# Altium schematic sheet MCU.SchDoc
size A
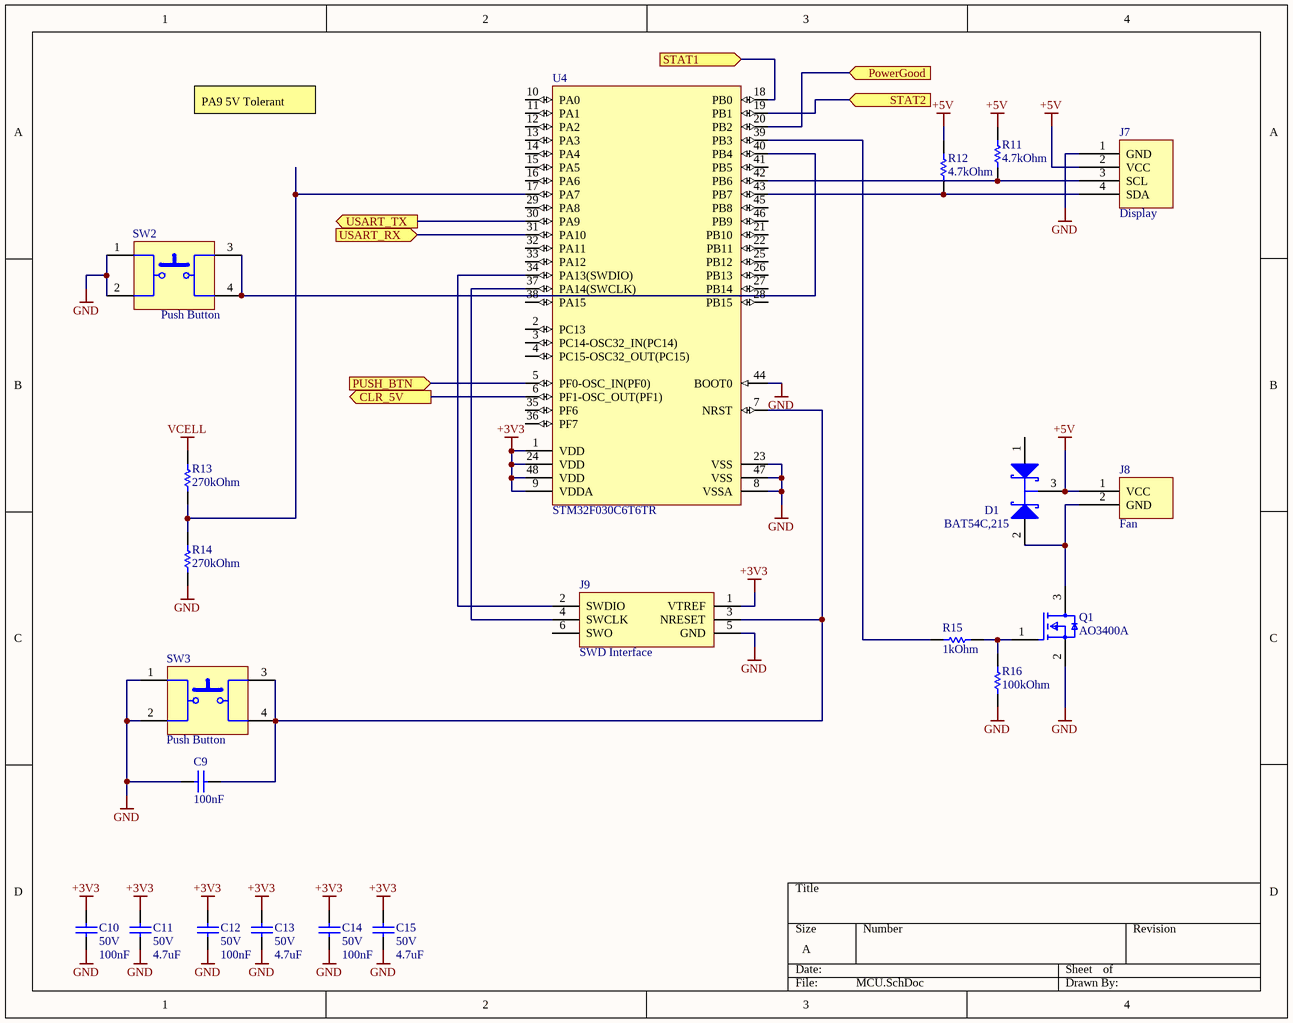
[diagram p0: MCU.SchDoc]

## Parts
C9  100nF  [CAP_0804]
C10  value 100nF  Voltage Rating: 50V  [CAPC2013X88X50ML20T25]  (hidden comment: Cap_0805)
C11  value 4.7uF  Voltage Rating: 50V  [CAPC2013X88X50ML20T25]  (hidden comment: Cap_0805)
C12  value 100nF  Voltage Rating: 50V  [CAPC2013X88X50ML20T25]  (hidden comment: Cap_0805)
C13  value 4.7uF  Voltage Rating: 50V  [CAPC2013X88X50ML20T25]  (hidden comment: Cap_0805)
C14  value 100nF  Voltage Rating: 50V  [CAPC2013X88X50ML20T25]  (hidden comment: Cap_0805)
C15  value 4.7uF  Voltage Rating: 50V  [CAPC2013X88X50ML20T25]  (hidden comment: Cap_0805)
D1  BAT54C,215  [SOT23]
J7  Display  [OLED_DISPLAY]
J8  Fan  [FAN_CONNECTOR]
J9  SWD Interface  [J-Link_6-pin_Needle_Adapter]  (no BOM)
Q1  AO3400A  [SOT23]
R11  4.7kOhm  [RES_0804]
R12  4.7kOhm  [RES_0804]
R13  270kOhm  [RES_0804]
R14  270kOhm  [RES_0804]
R15  1kOhm  [RES_0804]
R16  100kOhm  [RES_0804]
SW2  Push Button  [SWITCH]
SW3  Push Button  [SWITCH]
U4  STM32F030C6T6TR  [STM-LQFP48_M]

## Ports
CLR_5V (out), PowerGood (in), PUSH_BTN (in), STAT1 (in), STAT2 (in), USART_RX (in), USART_TX (out)

## Nets
+3V3: C10.2 C11.2 C12.2 C13.2 C14.2 C15.2 J9.1(VTREF) U4.1(VDD) U4.9(VDDA) U4.24(VDD) U4.48(VDD)
+5V: D1.3(K) J7.2(VCC) J8.1(VCC) R11.2 R12.2
GND: C9.1 C10.1 C11.1 C12.1 C13.1 C14.1 C15.1 J7.1(GND) J9.5(GND) Q1.2(S) R14.1 R16.1 SW2.1 SW2.2 SW3.1 SW3.2 U4.8(VSSA) U4.23(VSS) U4.44(BOOT0) U4.47(VSS)
VCELL: R13.2
CLR_5V: U4.6(PF1-OSC_OUT(PF1)) ; port CLR_5V
PowerGood: U4.20(PB2) ; port PowerGood
PUSH_BTN: U4.5(PF0-OSC_IN(PF0)) ; port PUSH_BTN
STAT1: U4.18(PB0) ; port STAT1
STAT2: U4.19(PB1) ; port STAT2
USART_RX: U4.31(PA10) ; port USART_RX
USART_TX: U4.30(PA9) ; port USART_TX
NetC9_2: C9.2 J9.3(NRESET) SW3.3 SW3.4 U4.7(NRST)
NetD1_2: D1.2(A) J8.2(GND) Q1.3(D)
NetJ7_3: J7.3(SCL) R11.1 U4.42(PB6)
NetJ7_4: J7.4(SDA) R12.1 U4.43(PB7)
NetJ9_2: J9.2(SWDIO) U4.34(PA13(SWDIO))
NetJ9_4: J9.4(SWCLK) U4.37(PA14(SWCLK))
NetQ1_1: Q1.1(G) R15.2 R16.2
NetR13_1: R13.1 R14.2 U4.17(PA7)
NetR15_1: R15.1 U4.39(PB3)
NetSW2_3: SW2.3 SW2.4 U4.40(PB4)

Not connected (* = marked no-connect by the designer): D1 1(A); J9 6(SWO); U4 2(PC13) 3(PC14-OSC32_IN(PC14)) 4(PC15-OSC32_OUT(PC15)) 10(PA0) 11(PA1) 12(PA2) 13(PA3) 14(PA4) 15(PA5) 16(PA6) 21(PB10) 22(PB11) 25(PB12) 26(PB13) 27(PB14) 28(PB15) 29(PA8) 32(PA11) 33(PA12) 35(PF6) 36(PF7) 38(PA15) 41(PB5) 45(PB8) 46(PB9)

## Notes on the sheet
- PA9 5V Tolerant

## Library data of the parts
C9 = CAP_100NF: PartNumber: 1206GC102KAT1A; Manufacturer: AVX; Capacitance: 0.001uF; Dielectric: X7R; Tolerance: 10%; Tolerance (%): ±10%; Voltage Rating DC: 2000V; Package Reference: 1206; Datasheet Version: 11/2010; Mounting Technology: SurfaceMount; Manufacturer URL: http://www.avx.com/; Datasheet URL: https://datasheet.ciiva.com/11787/0900766b80ed4c37-11787781.pdf; Package Description: 2-Pin SMD, Body 3.4 x 1.8 mm; Case Size/Dimension: 1206; Rated Voltage: 2000V
C10-C15 = Cap_0805: Ceramic Capacitor X7R
D1 = DIODE_BAT54C: Schottky Barrier Diode, 30 V, 3-Pin SOT23, RoHS, Tape and Reel; Manufacturer: NXP Semiconductors; Forward Surge Current Ifsm Max: 600mA; Pin Configuration: 1A1,2A2,3comK; Package Version: Feb-16; Forward Voltage VF Max: 800mV; SMD Marking: L43/*W1; Diode Case Style: SOT-23; Reverse Recovery Time trr Typ: 5ns; Forward Current If(AV): 200mA; Reel Quantity: 3000; SVHC: NoSVHC(19-Dec-2012); No. of Pins: 3; Junction Temperature Tj Max: 125degC; Common Connection: Cathode; Repetitive Reverse Voltage Vrrm Max: 30V; Operating Temperature Max: 150degC; Operating Temperature Range: -65degCto+150degC; Termination Type: SMD; Package Description: 3-Pin Small Outline Transistor, Body 1.3 x 2.9 mm, Pitch 0.95 mm; Package / Case: SOT-23; Diode Type: Schottky; Manufacturer URL: http://www.nxp.com/; Tape Width: 8mm; Package Reference: SOT23-3; Datasheet URL: https://datasheet.ciiva.com/33723/1668625-33723936.pdf; Datasheet Version: Rev. 5 , 10/2012; Operating Temperature Min: -65degC; Current Ifsm: 600mA; Reverse Recovery Time trr Max: 5ns; Package URL: http://www.nxp.com/documents/outline_drawing/SOT23.pdf; Forward Voltage: 800mV
J7 = Oled Display: Tiger Claw(TM) Socket Strip, Through-hole, Vertical, -55 to 105 degC, 2 mm Pitch, 4-Pin, Female, RoHS; Manufacturer: Samtec; PartNumber: MMS-104-01-T-SV; Pitch: 2 mm; PackageDescription: 2mm Through Hole Box Connector Strip Assembly; DatasheetVersion: F-214; ComponentLink1URL: http://www.samtec.com; RoHS: True; Temperature Range: -55 to 105 degC; ComponentLink1Description: Manufacturer URL; Mounting Technology: Through-hole; ComponentLink2Description: Datasheet; Orientation: Vertical; ComponentLink2URL: http://www.samtec.com/documents/webfiles/pdf/MMS.PDF; ComponentLink3Description: Package Specification; ComponentLink3URL: http://www.samtec.com/documents/webfiles/cpdf/MMS-1XX-01-XXX-XX-XXX-MKT1.pdf; PackageVersion: AO, 2/1993; PackageReference: MMS-104-01-X-SV
J8 = FAN: Tiger Claw(TM) Socket Strip, Through-hole, Vertical, -55 to 105 degC, 2 mm Pitch, 4-Pin, Female, RoHS; Manufacturer: Samtec; PartNumber: MMS-104-01-T-SV; Pitch: 2 mm; PackageDescription: 2mm Through Hole Box Connector Strip Assembly; DatasheetVersion: F-214; ComponentLink1URL: http://www.samtec.com; RoHS: True; Temperature Range: -55 to 105 degC; ComponentLink1Description: Manufacturer URL; Mounting Technology: Through-hole; ComponentLink2Description: Datasheet; Orientation: Vertical; ComponentLink2URL: http://www.samtec.com/documents/webfiles/pdf/MMS.PDF; ComponentLink3Description: Package Specification; ComponentLink3URL: http://www.samtec.com/documents/webfiles/cpdf/MMS-1XX-01-XXX-XX-XXX-MKT1.pdf; PackageVersion: AO, 2/1993; PackageReference: MMS-104-01-X-SV
J9 = J-Link_6-pin_Needle_Adapter: J-Link 6-pin Needle Adapter
Q1 = MOSFET_AO3400A: MOSFET N-CH 30V 5.7A SOT23; Input Capacitance: 630pF; Number of Elements: 1; Rds On Max: 26.5mR; Max Power Dissipation: 1.4W; Gate to Source Voltage (Vgs): 12V; Min Operating Temperature: -55°C; Lead Free: Lead Free; Number of Pins: 3; Drain to Source Voltage (Vdss): 30V; Case/Package: SOT-23; Mount: Surface Mount; Continuous Drain Current (ID): 5.7A; Radiation Hardening: No; Packaging: Tape and Reel; Max Operating Temperature: 150°C; Power Dissipation: 1.4W
R11 R12 = RES_4.7K: Part Number: CRCW120647K0FKEA; Manufacturer: Vishay Dale
R13 R14 = RES_270K: Part Number: CRCW120647K0FKEA; Manufacturer: Vishay Dale
R15 = RES_1K: Part Number: CRCW120647K0FKEA; Manufacturer: Vishay Dale
R16 = RES_100K: Part Number: CRCW120647K0FKEA; Manufacturer: Vishay Dale
SW2 SW3 = SWITCH: Micro Miniature Push Button Switch FSM JSM, 50 mA, -35 to 85 degC, 4-Pin SMD, RoHS, Tape and Reel; Manufacturer: TE Connectivity; Mechanical Life: 100000Cycles; Current Rating: 50mA; Actuator Material: Polyamide; Max Voltage Rating (DC): 12V; Capacitance: 0f; Illumination Type: Illuminated; Voltage Rating (DC): 24V; Case\/Package: SMD/SMT; Operating Force: 160gf; Contact Resistance: 100mOhm; Actuator Length: 0.055inch; Switch Travel: 0.25mm; Throw Configuration: SPST; Termination: GullWing; Contact Plating: Silver; Orientation: Straight; Mounting Technology: SurfaceMount; REACH SVHC: Unknown; Electrical Life: 100000Cycles; Package Reference: FSM4JSMATR; Max Operating Temperature: 85degC; Manufacturer URL: http://www.te.com/; Package Description: 4-Pin Surface Mount Device, Body 6 x 6 mm, Pitch 4.5 mm; Datasheet Version: Rev. V, 02/2015; Packaging: TapeandReel; Min Operating Temperature: -35degC; Mount: SurfaceMount; Contact Current Rating: 50mA; Contact Material: CopperAlloy; Package Quantity: 1200; Datasheet URL: http://www.te.com/commerce/DocumentDelivery/DDEController?Action=showdoc&DocId=Customer+Drawing%7F2-1437565-7%7FV%7Fpdf%7FEnglish%7FENG_CD_2-1437565-7_V.pdf%7F4-1437565-2; RoHSCompliant: true
U4 = STM-STM32F030C6-LQFP48_A: ARM Cortex-M0 32-bit MCU, 32 KB Flash, 4 KB Internal RAM, 39 I/Os, 48-Pin LQFP, -40 to 85 degC, Tape and Reel; Manufacturer: STMicroelectronics; I/Os (High Current): 39; FLASH Size (Prog) (kB): 32; Operating Frequency(F) (Processor speed) (MHz): 48; Supply Voltage(Vcc) min (V): 2.4; Internal RAM Size (kB): 4; Package Description: 48-Pin Low Profile Quad Flat Package, Body 7 x 7 mm, Pitch 0.5 mm; DatasheetVersion: Rev. 2; ComponentLink1URL: http://www.st.com/; ComponentLink2URL: http://www.st.com/st-web-ui/static/active/en/resource/technical/document/datasheet/DM00088500.pdf; Mounting Technology: Surface Mount; Core: ARM Cortex-M0; Package Reference: LQFP48; Packing: Tape and Reel; PartNumber: STM32F030C6T6TR; ComponentLink2Description: Datasheet; ComponentLink1Description: Manufacturer URL